# EAGLE design interface (EAGLE 5.06)
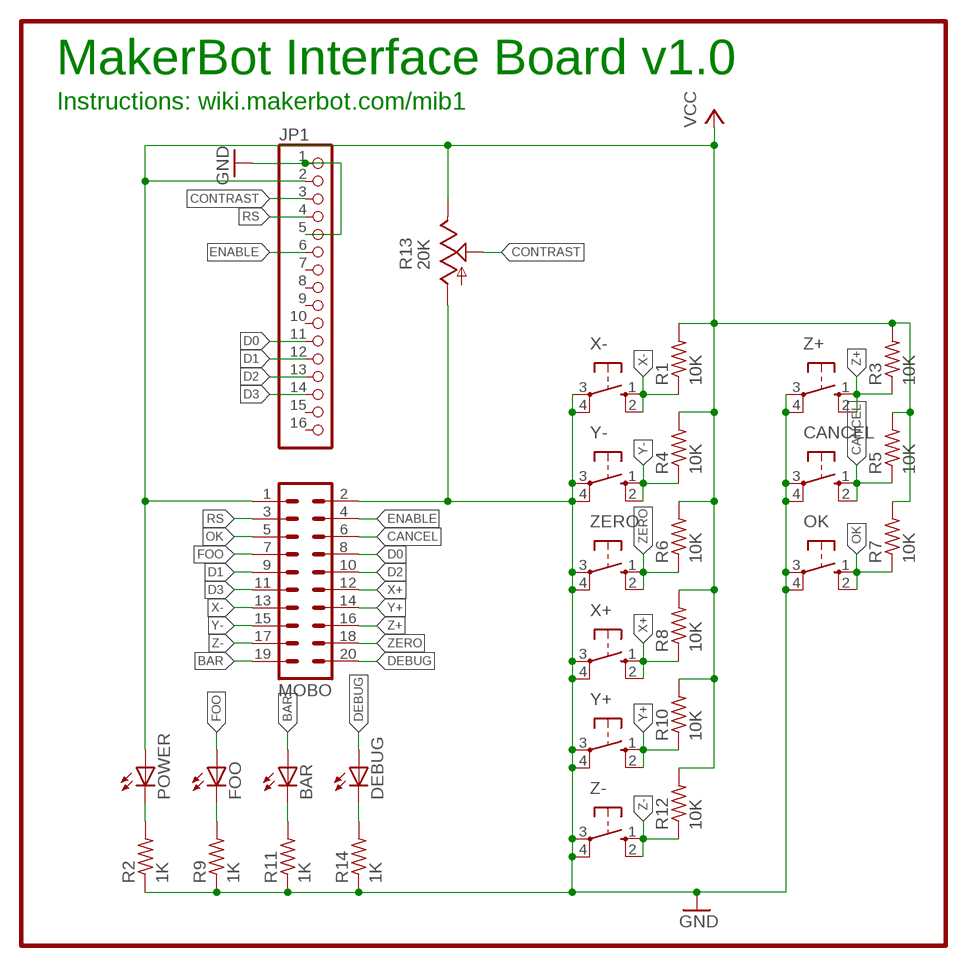
[diagram p0: schematic, sheet 1]

## Parts
BAR  LED5MM  [LED5MM]
CANCEL  40-XX  [B3F-40XX]
DEBUG  LED5MM  [LED5MM]
FOO  LED5MM  [LED5MM]
JP1  PINHD-1X16  [1X16]
MOBO  ML20L  [ML20L]
OK  40-XX  [B3F-40XX]
POWER  LED5MM  [LED5MM]
R1  10K  R-US_M1206  [M1206]
R2  1K  R-US_M1206  [M1206]
R3  10K  R-US_M1206  [M1206]
R4  10K  R-US_M1206  [M1206]
R5  10K  R-US_M1206  [M1206]
R6  10K  R-US_M1206  [M1206]
R7  10K  R-US_M1206  [M1206]
R8  10K  R-US_M1206  [M1206]
R9  1K  R-US_M1206  [M1206]
R10  10K  R-US_M1206  [M1206]
R11  1K  R-US_M1206  [M1206]
R12  10K  R-US_M1206  [M1206]
R13  20K  TRIM_US-B25P  [B25P]
R14  1K  R-US_M1206  [M1206]
X+  40-XX  [B3F-40XX]
X-  40-XX  [B3F-40XX]
Y+  40-XX  [B3F-40XX]
Y-  40-XX  [B3F-40XX]
Z+  40-XX  [B3F-40XX]
Z-  40-XX  [B3F-40XX]
ZERO  40-XX  [B3F-40XX]

## Nets
BAR: BAR.A MOBO.19
CANCEL: CANCEL.1(S) CANCEL.2(S1) MOBO.6 R5.1
CONTRAST: JP1.3 R13.S
D0: JP1.11 MOBO.8
D1: MOBO.9
D2: JP1.13 MOBO.10
D3: JP1.14 MOBO.11
DEBUG: DEBUG.A MOBO.20
ENABLE: JP1.6 MOBO.4
FOO: FOO.A MOBO.7
GND: CANCEL.3(P) CANCEL.4(P1) JP1.1 JP1.5 MOBO.2 OK.3(P) OK.4(P1) R2.1 R9.1 R11.1 R13.A R14.1 X+.3(P) X+.4(P1) X-.3(P) X-.4(P1) Y+.3(P) Y+.4(P1) Y-.3(P) Y-.4(P1) Z+.3(P) Z+.4(P1) Z-.3(P) Z-.4(P1) ZERO.3(P) ZERO.4(P1)
N$1: POWER.K(C) R2.2
N$2: FOO.K(C) R9.2
N$3: BAR.K(C) R11.2
N$4: DEBUG.K(C) R14.2
OK: MOBO.5 OK.1(S) OK.2(S1) R7.1
RS: JP1.4 MOBO.3
VCC: JP1.2 MOBO.1 POWER.A R1.2 R3.2 R4.2 R5.2 R6.2 R7.2 R8.2 R10.2 R12.2 R13.E
X+: MOBO.12 R8.1 X+.1(S) X+.2(S1)
X-: MOBO.13 R1.1 X-.1(S) X-.2(S1)
Y+: MOBO.14 R10.1 Y+.1(S) Y+.2(S1)
Y-: MOBO.15 R4.1 Y-.1(S) Y-.2(S1)
Z+: MOBO.16 R3.1 Z+.1(S) Z+.2(S1)
Z-: MOBO.17 R12.1 Z-.1(S) Z-.2(S1)
ZERO: MOBO.18 R6.1 ZERO.1(S) ZERO.2(S1)
Unconnected: JP1.7 JP1.8 JP1.9 JP1.10 JP1.12 JP1.15 JP1.16

## Notes on the sheet
- MakerBot Interface Board v1.0
- Instructions: wiki.makerbot.com/mib1

## Library data of the parts
BAR DEBUG FOO POWER = led:LED: LED OSRAM: - CHIPLED LG R971, LG N971, LY N971, LG Q971, LY Q971, LO R971, LY R971 LH N974, LH R974 LS Q976, LO Q976, LY Q976 LO Q996 - Hyper CHIPLED LW Q18S LB Q993, LB Q99A, LB R99A - SideLED LS A670, LO A670, LY A670, LG A670, LP A670 LB A673, LV A673, LT A673, LW A673 LH A674 LY A675 LS A676, LA A676, LO A676, LY A676, LW A676 LS A679, LY A679, LG A679 - Hyper Micro SIDELED® LS Y876, LA Y876, LO Y876, LY Y876 LT Y87S - SmartLED LW L88C, LW L88S LB L89C, LB L89S, LG L890 LS L89K, LO L89K, LY L89K LS L896, LA L896, LO L896, LY L896 - TOPLED LS T670, LO T670, LY T670, LG T670, LP T670 LSG T670, LSP T670, LSY T670, LOP T670, LYG T670 LG T671, LOG T671, LSG T671 LB T673, LV T673, LT T673, LW T673 LH T674 LS T676, LA T676, LO T676, LY T676, LB T676, LH T676, LSB T676, LW T676 LB T67C, LV T67C, LT T67C, LS T67K, LO T67K, LY T67K, LW E67C LS E67B, LA E67B, LO E67B, LY E67B, LB E67C, LV E67C, LT E67C LW T67C LS T679, LY T679, LG T679 LS T770, LO T770, LY T770, LG T770, LP T770 LB T773, LV T773, LT T773, LW T773 LH T774 LS E675, LA E675, LY E675, LS T675 LS T776, LA T776, LO T776, LY T776, LB T776 LHGB T686 LT T68C, LB T68C - Hyper Mini TOPLED® LB M676 - Mini TOPLED Santana® LG M470 LS M47K, LO M47K, LY M47K Source: http://www.osram.convergy.de LUXEON: - LUMILED® LXK2-PW12-R00, LXK2-PW12-S00, LXK2-PW14-U00, LXK2-PW14-V00 LXK2-PM12-R00, LXK2-PM12-S00, LXK2-PM14-U00 LXK2-PE12-Q00, LXK2-PE12-R00, LXK2-PE12-S00, LXK2-PE14-T00, LXK2-PE14-U00 LXK2-PB12-K00, LXK2-PB12-L00, LXK2-PB12-M00, LXK2-PB14-N00, LXK2-PB14-P00, LXK2-PB14-Q00 LXK2-PR12-L00, LXK2-PR12-M00, LXK2-PR14-Q00, LXK2-PR14-R00 LXK2-PD12-Q00, LXK2-PD12-R00, LXK2-PD12-S00 LXK2-PH12-R00, LXK2-PH12-S00 LXK2-PL12-P00, LXK2-PL12-Q00, LXK2-PL12-R00 Source: www.luxeon.com KINGBRIGHT: KA-3528ASYC Source: www.kingbright.com
CANCEL OK X+ X- Y+ Y- Z+ Z- ZERO = switch-omron:40-XX: OMRON SWITCH
JP1 = pinhead:PINHD-1X16: PIN HEADER
MOBO = con-harting-ml:ML20: HARTING
R1-R12 R14 = rcl:R-US_: RESISTOR, American symbol
R13 = pot:TRIM_US-: POTENTIOMETER

## Net classes
0 default: width 0.381 mm, clearance 0.381 mm

## Board
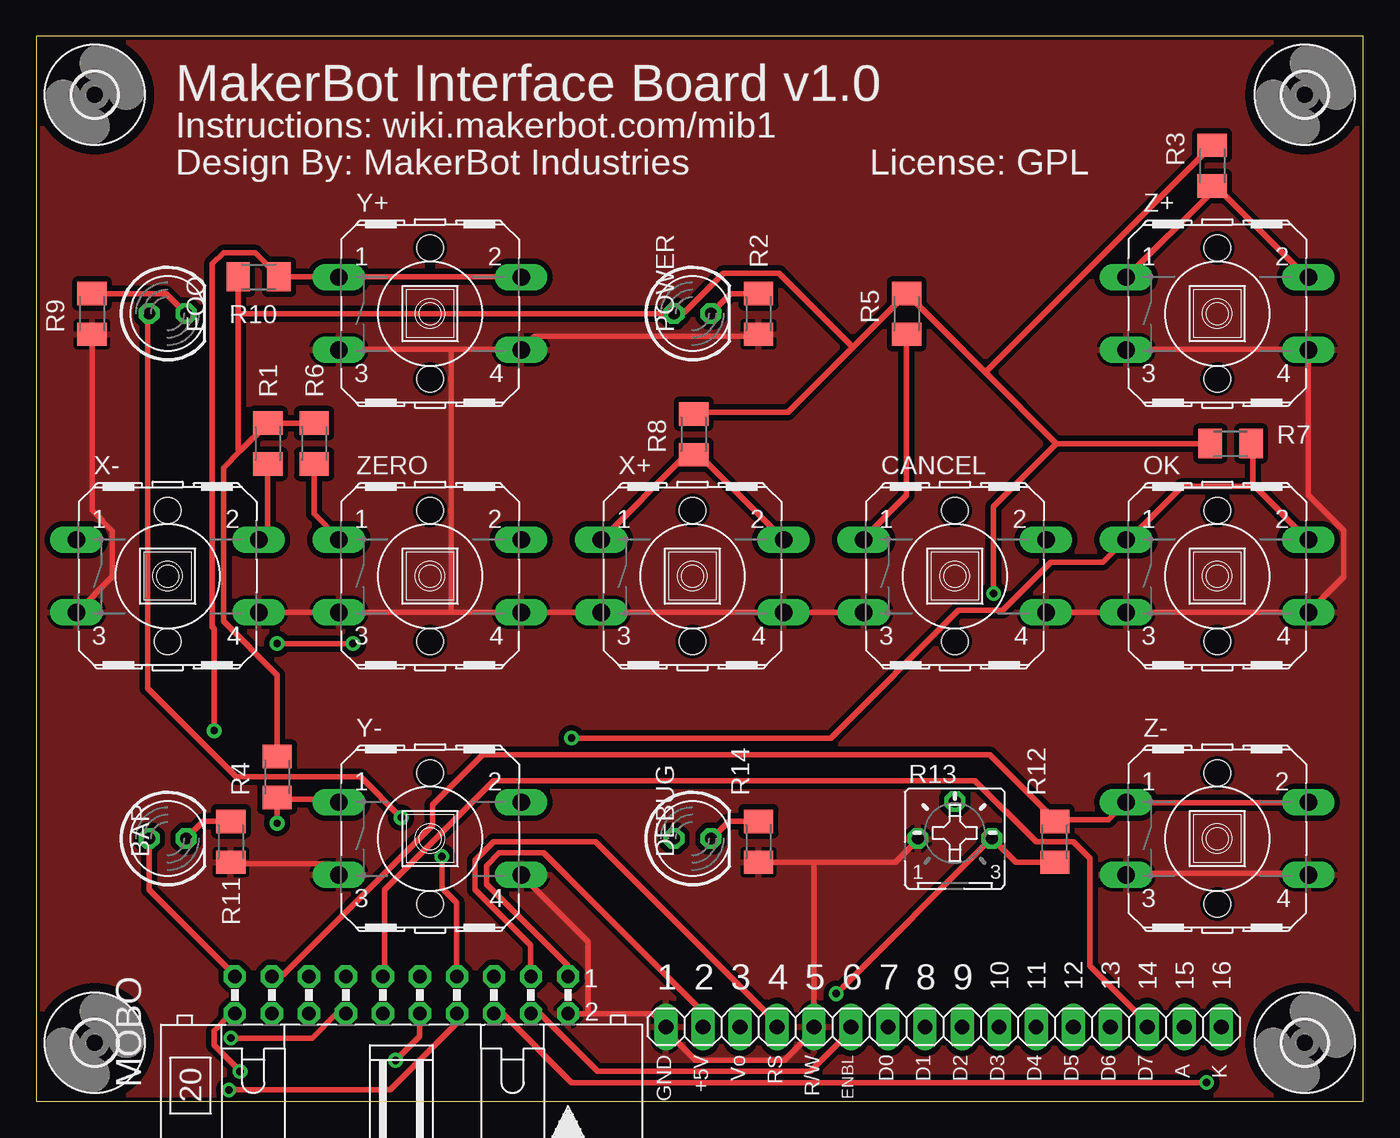
[diagram p1: board, top side]
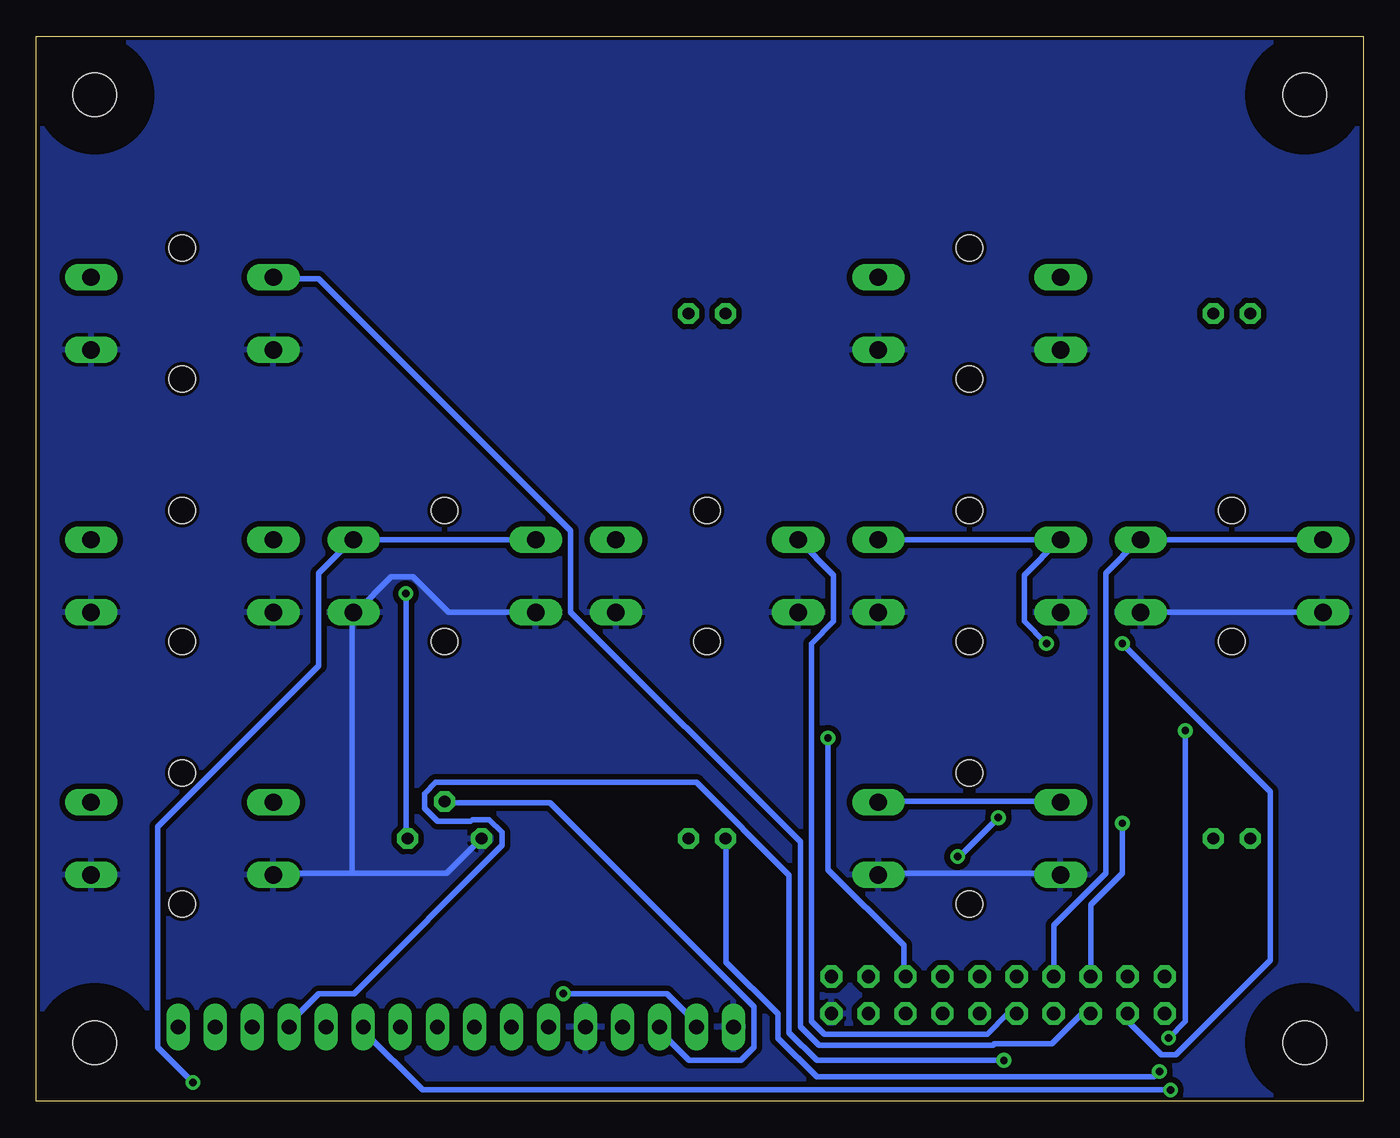
[diagram p2: board, bottom side, seen from below]

Size 91 x 73.02 mm. Coordinates in mm from the lower left corner, seen from the top.
Outline: 0,0 91,0 91,73.02 0,73.02 0,0
Copper layers (1*16): Top 0.035mm / dielectric 1.5mm / Bottom 0.035mm
Design rules "SparkFun": minimum track width 8mil, minimum drill 20mil, track to track 8mil, track to pad 8mil, pad to pad 8mil, via to via 8mil, smd to smd 8mil, copper to edge 10mil, drill to drill 8mil, minimum pad ring 12mil, minimum via ring 10mil, stop-mask expansion 4mil, vias tented up to drill 25mil, thermal gap 10mil

### Footprints (pad centres in the part's own frame; a part is rotated, then mirrored left to right if it is on the bottom)
LED5MM = drill 0.813 octagon: A -1.27,0; K 1.27,0
B3F-40XX = drill 1.194 long: 1 -6.248,2.489; 2 6.248,2.489; 3 -6.248,-2.489; 4 6.248,-2.489 | hole 1.803: 0,-4.496; 0,4.496
1X16 = drill 1.016 long: 1 -19.05,0; 2 -16.51,0; 3 -13.97,0; 4 -11.43,0; 5 -8.89,0; 6 -6.35,0; 7 -3.81,0; 8 -1.27,0; 9 1.27,0; 10 3.81,0; 11 6.35,0; 12 8.89,0; 13 11.43,0; 14 13.97,0; 15 16.51,0; 16 19.05,0
ML20L = drill 0.914 octagon: 1 -11.43,-1.27; 2 -11.43,1.27; 3 -8.89,-1.27; 4 -8.89,1.27; 5 -6.35,-1.27; 6 -6.35,1.27; 7 -3.81,-1.27; 8 -3.81,1.27; 9 -1.27,-1.27; 10 -1.27,1.27; 11 1.27,-1.27; 12 1.27,1.27; 13 3.81,-1.27; 14 3.81,1.27; 15 6.35,-1.27; 16 6.35,1.27; 17 8.89,-1.27; 18 8.89,1.27; 19 11.43,-1.27; 20 11.43,1.27
M1206 = smd 1.6 x 2: 1 -1.4,0; 2 1.4,0
B25P = drill 0.813 octagon: A -2.54,0; E 2.54,0; S 0,2.54
3,0 = hole 3: 0,0

### Placement (x,y rotation side)
BAR  9,18.02 0 top
CANCEL  63,36.02 0 top
DEBUG  45,18.02 0 top
FOO  9,54.02 0 top
JP1  62.23,5.09 0 top
MOBO  25.04,7.28 180 top
OK  81,36.02 0 top
POWER  45,54.02 0 top
R1  15.88,45.1 90 top
R2  49.53,53.99 90 top
R3  80.64,64.15 90 top
R4  16.51,22.24 90 top
R5  59.69,53.99 90 top
R6  19.05,45.1 90 top
R7  81.92,45.1 180 top
R8  45.09,45.73 90 top
R9  3.81,53.99 90 top
R10  15.24,56.53 180 top
R11  13.34,17.8 90 top
R12  69.85,17.8 270 top
R13  63,18.02 0 top
R14  49.53,17.8 90 top
U$1  [3,0]  4,69.02 0 top
U$2  [3,0]  4,4.01 0 top
U$3  [3,0]  87,69.02 0 top
U$4  [3,0]  87,4.01 0 top
X+  45,36.02 0 top
X-  9,36.02 0 top
Y+  27,54.02 0 top
Y-  27,18.02 0 top
Z+  81,54.02 0 top
Z-  81,18.02 0 top
ZERO  27,36.02 0 top

### Tracks (layer width: path | path; a pad name or v marks a point on that pad's centre or on a via)
BAR
  Top 0.381: BAR.A 7.75,17.92 7.75,14.49 13.59,8.65 MOBO.19
CANCEL  (via drill 0.51)
  Top 0.381: R5.1 59.69,41.54 56.77,38.62 CANCEL.1 | v80.26,1.28 36.7,1.28 32,5.98 31.5,5.98 MOBO.6
  Bottom 0.381: v80.26,1.28 82.68,3.7 82.68,18.81 71.63,29.86 71.63,36.21 69.34,38.5 CANCEL.2 69.09,38.5 56.77,38.5 CANCEL.1
CONTRAST
  Bottom 0.381: JP1.3 48.26,4.84 46.23,2.81 42.67,2.81 41.78,3.7 41.78,6.49 55.75,20.46 62.99,20.46 R13.S
D0  (via drill 0.51)
  Top 0.381: v13.21,0.78 24.26,0.78 28.83,5.35 28.83,5.98 MOBO.8
  Bottom 0.381: v13.21,0.78 64.52,0.78 68.58,4.84 JP1.11
D2  (via drill 0.51)
  Top 0.381: v24.64,2.81 26.29,4.46 26.29,5.98 MOBO.10
  Bottom 0.381: v24.64,2.81 37.47,2.81 39.37,4.71 39.37,15.51 45.72,21.86 63.63,21.86 64.39,21.1 64.39,20.08 63.5,19.19 61.21,19.19 61.09,19.32 59.94,19.32 59.05,18.43 59.05,17.54 69.22,7.38 71.63,7.38 73.66,5.35 JP1.13
D3
  Top 0.381: JP1.14 76.2,5.35 72.26,9.29 72.26,16.65 71.12,17.8 68.58,17.8 64.39,21.99 31.37,21.99 23.88,14.49 23.88,8.65 MOBO.11
DEBUG  (via drill 0.51)
  Top 0.381: v13.97,2.05 12.19,3.83 12.19,4.84 13.34,5.98 13.59,5.98 MOBO.20
  Bottom 0.381: v13.97,2.05 14.35,1.67 37.47,1.67 40.13,4.33 40.13,5.98 43.69,9.54 43.69,17.92 DEBUG.A
ENABLE
  Top 0.381: JP1.6 55.88,4.84 53.09,2.05 38.48,2.05 34.54,5.98 34.04,5.98 MOBO.4
FOO  (via drill 0.51)
  Top 0.381: v25.02,19.45 22.23,22.24 13.72,22.24 7.62,28.34 7.62,53.99 FOO.A | v27.81,16.78 27.81,14.62 28.83,13.6 28.83,8.65 MOBO.7
  Bottom 0.381: v25.02,19.45 27.69,16.78 v27.81,16.78
GND
  Top 0.381: R2.1 49.53,52.47 34.16,52.47 33.27,51.58 Y+.4 33.15,51.58 28.45,51.58 | 28.45,51.58 20.83,51.58 Y+.3 | R9.1 3.81,40.53 5.21,39.13 5.21,35.96 2.79,33.54 X-.3 | CANCEL.3 56.64,33.54 51.31,33.54 X+.4 51.05,33.54 38.86,33.54 X+.3 38.73,33.54 33.27,33.54 ZERO.4 33.15,33.54 28.45,33.54 | X-.4 15.37,33.54 20.7,33.54 ZERO.3 20.95,33.54 28.45,33.54 | 28.45,33.54 28.45,51.58 | 37.85,5.98 42.29,5.98 JP1.1 43.31,4.97 43.31,4.71 45.21,2.81 51.31,2.81 53.47,4.97 JP1.5 53.34,16.4 | 37.85,5.98 36.58,5.98 MOBO.2 | R11.1 13.34,16.27 20.07,16.27 20.7,15.64 Y-.3 | 37.85,5.98 37.85,10.94 33.27,15.51 Y-.4 | Z+.3 74.8,51.58 87.12,51.58 Z+.4 87.25,51.32 87.25,41.54 89.66,39.13 89.66,35.96 87.38,33.67 OK.4 87.12,33.54 74.93,33.54 OK.3 74.68,33.54 69.34,33.54 CANCEL.4 | Z-.3 74.8,15.64 87.12,15.64 Z-.4 | 53.34,16.4 58.93,16.4 60.45,17.92 R13.A | 53.34,16.4 R14.1
  Bottom 0.381: X-.3 2.79,33.54 15.24,33.54 X-.4 | Y-.4 33.15,15.64 20.83,15.64 Y-.3 | 69.34,15.64 62.87,15.64 60.58,17.92 R13.A | 69.34,15.64 74.68,15.64 Z-.3 | 69.34,15.64 69.34,33.42 CANCEL.4 69.09,33.54 66.67,35.96 65.15,35.96 62.74,33.54 56.77,33.54 CANCEL.3
  pour Bottom: -1.27,73.67 91.44,73.67 91.44,-1.26 -1.27,-1.26
  pour Top: -1.27,73.67 91.44,73.67 91.44,-1.26 -1.27,-1.26
N$1
  Top 0.381: R2.2 47.62,55.39 46.35,54.12 POWER.K
N$2
  Top 0.381: R9.2 8.89,55.39 10.16,54.12 FOO.K
N$3
  Top 0.381: R11.2 11.43,19.19 10.29,18.05 BAR.K
N$4
  Top 0.381: R14.2 47.5,19.19 46.35,18.05 DEBUG.K
OK  (via drill 0.51)
  Top 0.381: 83.44,42.31 83.44,45.1 R7.1 | 83.44,42.31 87.12,38.62 OK.2 | v36.7,24.91 54.48,24.91 63.25,33.67 66.29,33.67 69.6,36.97 73.15,36.97 74.68,38.5 OK.1 74.93,38.5 78.61,42.18 83.31,42.18 83.44,42.31
  Bottom 0.381: v36.7,24.91 36.7,15.89 31.5,10.68 31.5,8.65 MOBO.5
RS
  Top 0.381: JP1.4 50.8,5.35 38.35,17.8 31.37,17.8 30.1,16.53 30.1,14.49 33.91,10.68 33.91,8.65 MOBO.3
VCC  (via drill 0.51)
  Top 0.381: R12.2 67.18,16.4 65.66,17.92 R13.E 65.41,17.92 v54.86,7.38 | JP1.2 45.72,6.11 34.8,17.03 31.75,17.03 30.86,16.14 30.86,14.87 36.45,9.29 36.45,8.65 MOBO.1 | R6.2 R1.2 15.75,46.37 13.97,44.59 | 13.97,44.59 12.83,43.45 12.83,32.91 16.51,29.23 R4.2 | 13.84,53.99 13.84,44.72 13.97,44.59 | 13.84,53.99 R10.2 | 56.01,51.7 R5.2 59.82,55.26 65.09,49.99 | 56.01,51.7 51.56,47.26 45.09,47.26 R8.2 | 65.09,49.99 69.98,45.1 | 69.98,45.1 R7.2 | R3.2 65.09,49.99 | 56.01,51.7 50.93,56.78 47.12,56.78 44.45,54.12 43.81,54.12 POWER.A 43.56,53.99 13.84,53.99 | v65.66,34.81 65.66,40.78 69.98,45.1
  Bottom 0.381: v54.86,7.38 47.75,7.38 45.72,5.35 JP1.2 | v65.66,34.81 65.66,18.05 R13.E
X+
  Top 0.381: X+.2 51.18,38.62 45.59,44.21 45.09,44.21 R8.1 44.96,44.08 44.32,44.08 38.86,38.62 X+.1
  Bottom 0.381: MOBO.12 23.88,5.98 24.38,5.98 25.78,4.59 36.96,4.59 37.85,5.48 37.85,31.38 36.32,32.91 36.32,36.08 38.73,38.5 X+.1
X-
  Top 0.381: R1.1 15.88,39.13 15.37,38.62 X-.2
  Bottom 0.381: MOBO.13 21.21,8.65 21.21,12.08 17.65,15.64 17.65,36.21 15.37,38.5 X-.2 15.11,38.5 2.79,38.5 X-.1
Y+  (via drill 0.51)
  Top 0.381: v13.34,4.33 18.92,4.33 20.57,5.98 21.21,5.98 MOBO.14 | v12.19,25.41 12.19,32.4 12.06,32.53 12.06,57.42 12.83,58.18 14.99,58.18 16.51,56.66 R10.1 20.7,56.53 Y+.1 20.83,56.53 33.15,56.53 Y+.2
  Bottom 0.381: v13.34,4.33 12.19,5.48 v12.19,25.41
Y-  (via drill 0.51)
  Top 0.381: Y-.1 20.7,20.59 20.57,20.72 16.51,20.72 R4.1 v16.51,19.07
  Bottom 0.381: v16.51,19.07 16.51,15.64 18.67,13.48 18.67,8.65 MOBO.15 | Y-.2 33.15,20.59 20.83,20.59 Y-.1
Z+
  Top 0.381: Z+.1 74.8,56.53 80.64,62.37 R3.1 80.77,62.88 87.12,56.53 Z+.2
  Bottom 0.381: MOBO.16 18.8,5.98 19.3,5.98 21.34,3.95 25.27,3.95 25.4,3.83 37.34,3.83 38.61,5.09 38.61,17.8 54.36,33.54 54.36,39.13 71.63,56.4 74.68,56.4 Z+.1
Z-
  Top 0.381: MOBO.17 16.26,8.65 16.89,8.65 27.18,18.94 27.18,20.34 30.61,23.76 65.41,23.76 69.72,19.45 R12.1 69.85,19.32 73.53,19.32 74.68,20.46 Z-.1 74.93,20.46 87.12,20.46 Z-.2
ZERO  (via drill 0.51)
  Top 0.381: R6.1 19.05,40.27 20.7,38.62 ZERO.1 | v16.51,31.38 v21.72,31.38
  Bottom 0.381: v16.51,31.38 6.35,21.22 6.35,9.67 12.83,3.19 13.84,3.19 16.13,5.48 16.13,5.98 MOBO.18 | v21.72,31.38 23.24,32.91 23.24,36.08 20.83,38.5 ZERO.1 21.08,38.5 33.15,38.5 ZERO.2

### Text on the board
tPlace: MakerBot Interface Board v1.0 | Instructions: wiki.makerbot.com/mib1 | Design By: MakerBot Industries | License: GPL | 1 | 2 | 3 | 4 | 5 | 6 | 7 | 8 | 9 | 10 | 11 | 12 | 13 | 14 | 15 | 16 | GND | +5V | Vo | RS | R/W | ENBL | D0 | D1 | D2 | D3 | D4 | D5 | D6 | D7 | A | K